# Altium project DIOT_Kasli_Adapter.PrjPCB (part 4 of 4)
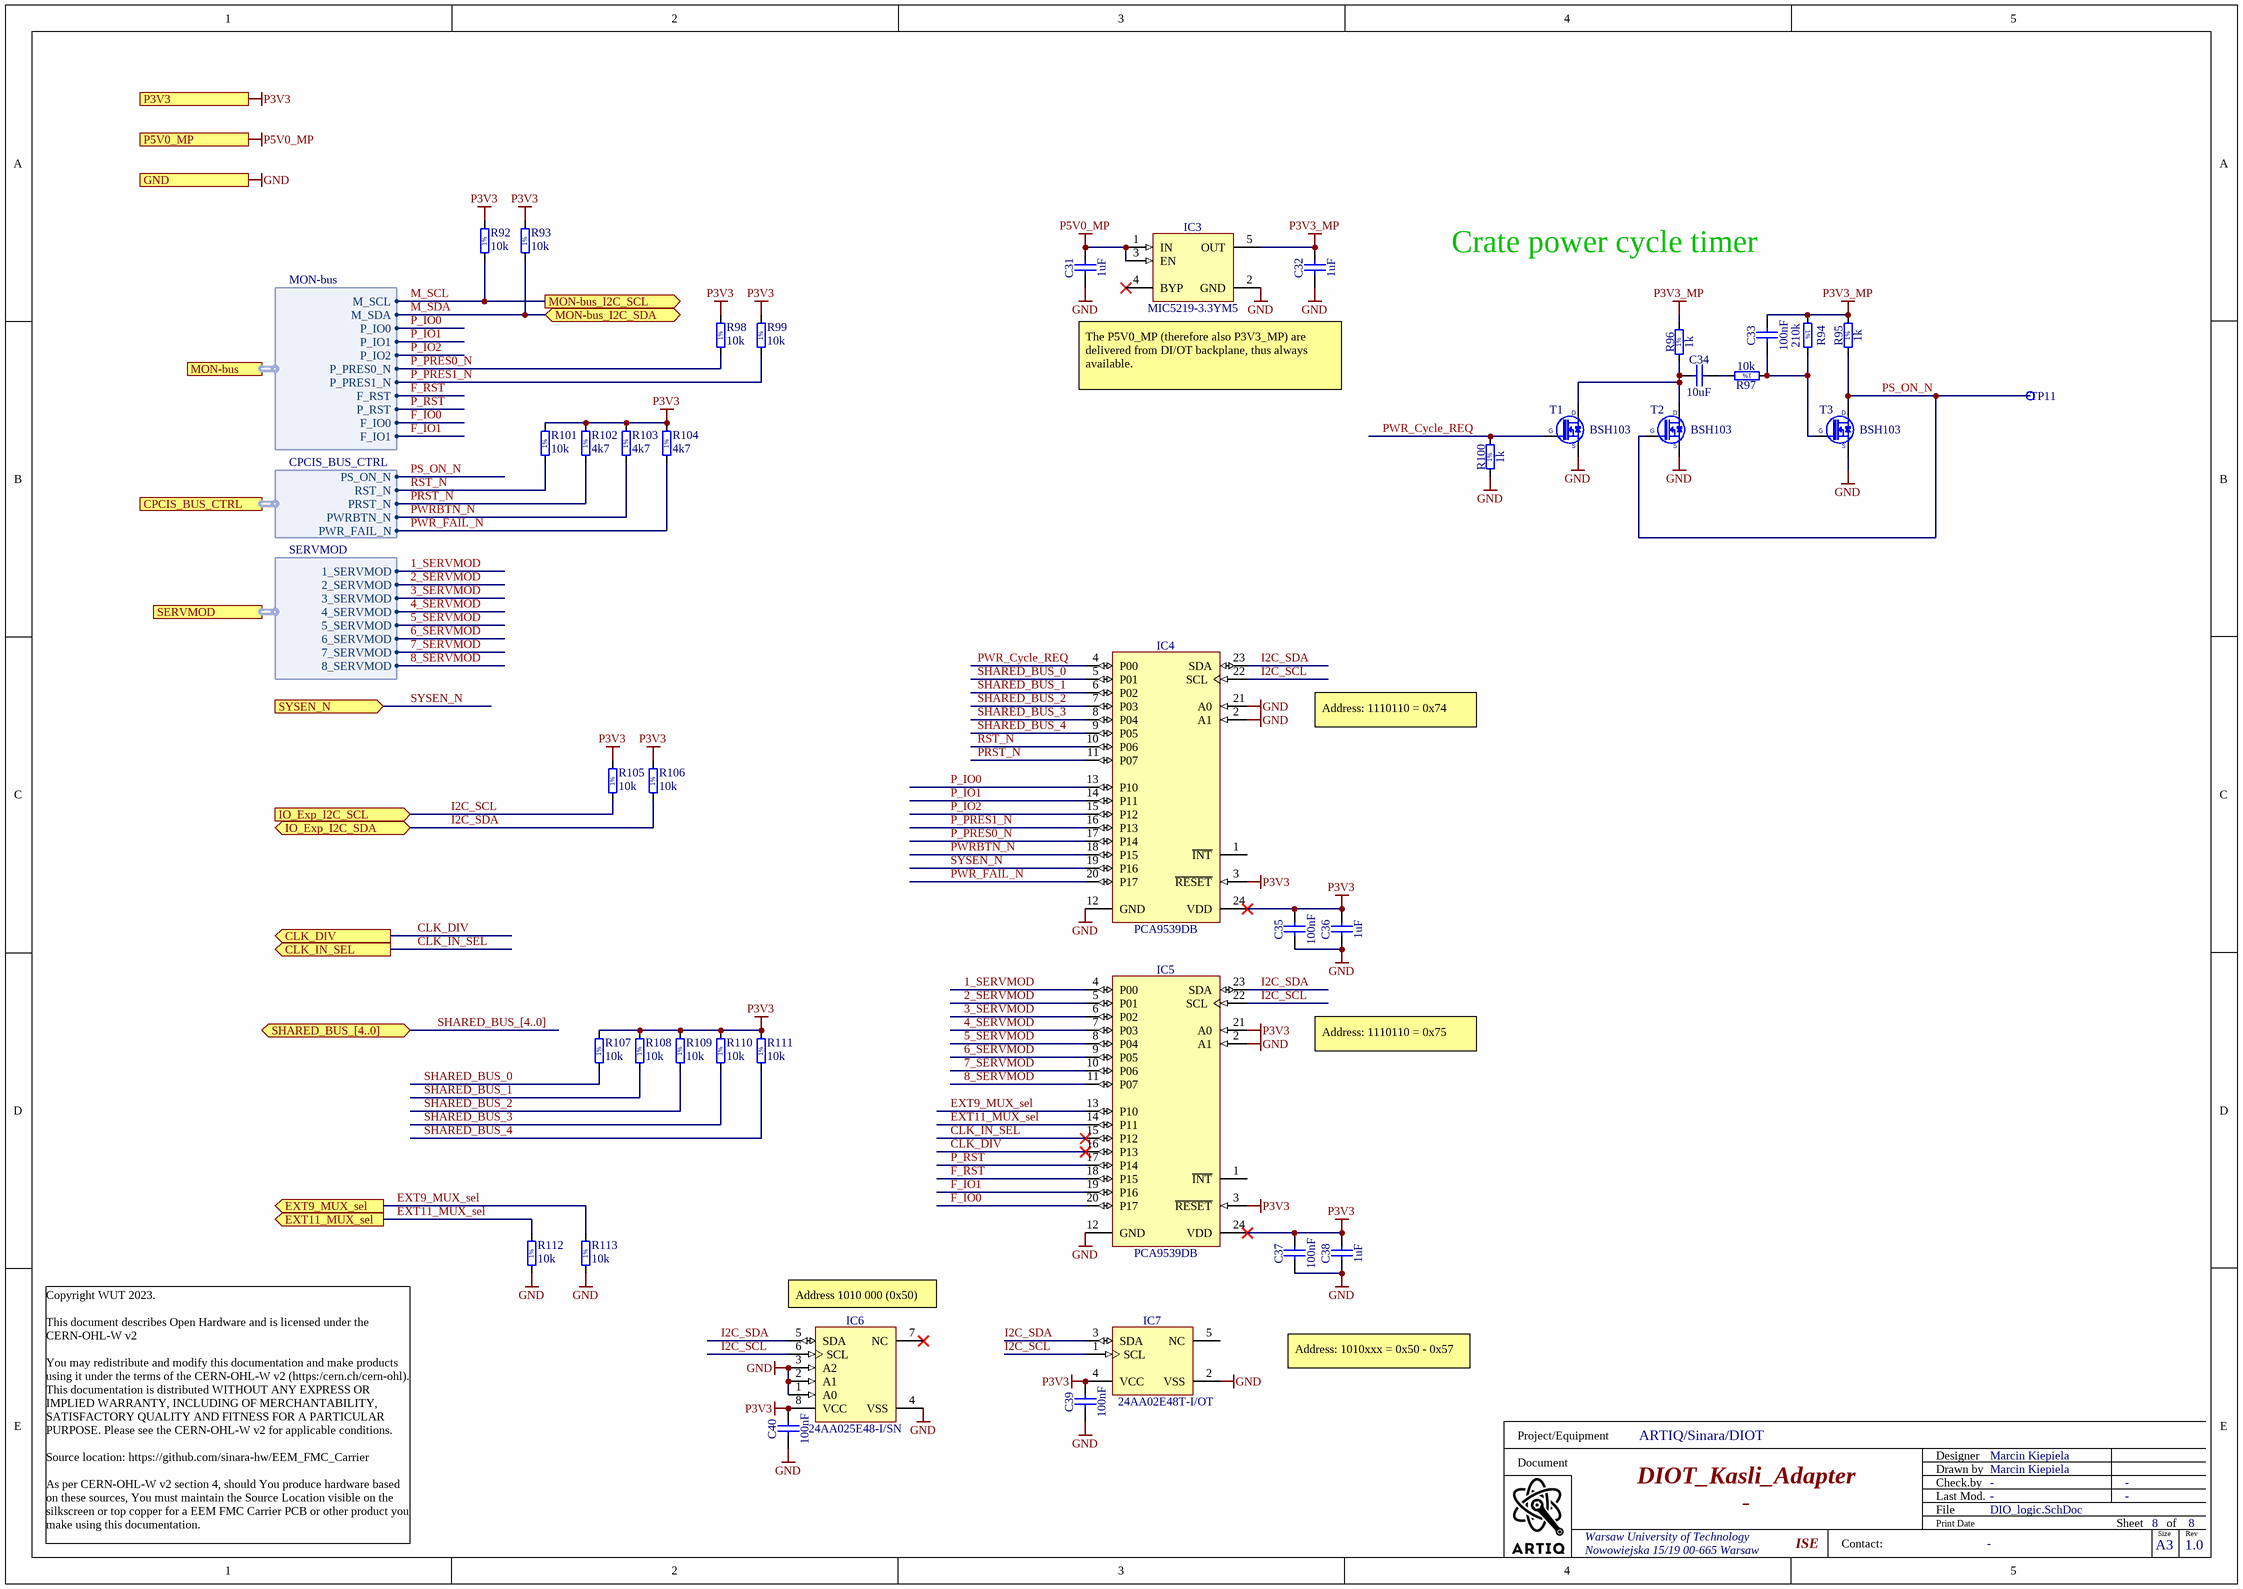
[diagram p8: DIO_logic.SchDoc]

## Nets that join several sheets
GND: DIOT_Kasli_Adapter (6 pins), Cpcis_connectors_P4_P5_P6 (80 pins), IDC_EXT_Connectors (120 pins), Clock_Distribution (30 pins), MUX_EEM_EXT (48 pins), DIO_logic (25 pins)
P3V3: DIOT_Kasli_Adapter (TP9.1), IDC_EXT_Connectors (24 pins), Clock_Distribution (5 pins), MUX_EEM_EXT (16 pins), DIO_logic (28 pins)
P5V0_MP: DIOT_Kasli_Adapter (TP7.1), DIO_logic (C31.2 IC3.1 IC3.3)
P12V0: DIOT_Kasli_Adapter (TP8.1), IDC_EXT_Connectors (24 pins)
1_PE_CLK_N: Cpcis_connectors_P4_P5_P6 (J7.B5), Clock_Distribution (IC1.9)
1_PE_CLK_P: Cpcis_connectors_P4_P5_P6 (J7.A5), Clock_Distribution (IC1.10)
2_PE_CLK_N: Cpcis_connectors_P4_P5_P6 (J7.E5), Clock_Distribution (IC1.7)
2_PE_CLK_P: Cpcis_connectors_P4_P5_P6 (J7.D5), Clock_Distribution (IC1.8)
3_PE_CLK_N: Cpcis_connectors_P4_P5_P6 (J7.H5), Clock_Distribution (IC1.4)
3_PE_CLK_P: Cpcis_connectors_P4_P5_P6 (J7.G5), Clock_Distribution (IC1.5)
4_PE_CLK_N: Cpcis_connectors_P4_P5_P6 (J7.K5), Clock_Distribution (IC1.42)
4_PE_CLK_P: Cpcis_connectors_P4_P5_P6 (J7.J5), Clock_Distribution (IC1.43)
5_PE_CLK_N: Cpcis_connectors_P4_P5_P6 (J7.C6), Clock_Distribution (IC1.37)
5_PE_CLK_P: Cpcis_connectors_P4_P5_P6 (J7.B6), Clock_Distribution (IC1.38)
6_PE_CLK_N: Cpcis_connectors_P4_P5_P6 (J7.F6), Clock_Distribution (IC1.35)
6_PE_CLK_P: Cpcis_connectors_P4_P5_P6 (J7.E6), Clock_Distribution (IC1.36)
7_PE_CLK_N: Cpcis_connectors_P4_P5_P6 (J7.I6), Clock_Distribution (IC1.40)
7_PE_CLK_P: Cpcis_connectors_P4_P5_P6 (J7.H6), Clock_Distribution (IC1.41)
8_PE_CLK_N: Cpcis_connectors_P4_P5_P6 (J7.L6), Clock_Distribution (IC1.29)
8_PE_CLK_P: Cpcis_connectors_P4_P5_P6 (J7.K6), Clock_Distribution (IC1.30)
CLK_DIV: Clock_Distribution (D1.3 R1.1), DIO_logic (IC5.16)
CLK_IN_SEL: Clock_Distribution (R6.1), DIO_logic (IC5.15)
EXT9_MUX_sel: MUX_EEM_EXT (IC8.9 IC9.9 IC10.9 IC11.9), DIO_logic (IC5.13 R113.2)
EXT11_MUX_sel: MUX_EEM_EXT (IC12.9 IC13.9 IC14.9 IC15.9), DIO_logic (IC5.14 R112.2)
I2C_SCL_8: DIOT_Kasli_Adapter (TP1.1), IDC_EXT_Connectors (J17.27), DIO_logic (R92.1)
I2C_SCL_9: DIOT_Kasli_Adapter (TP3.1), IDC_EXT_Connectors (J18.27)
I2C_SCL_11: DIOT_Kasli_Adapter (TP5.1), IDC_EXT_Connectors (J20.27), DIO_logic (5 pins)
I2C_SDA_8: DIOT_Kasli_Adapter (TP2.1), IDC_EXT_Connectors (J17.26), DIO_logic (R93.1)
I2C_SDA_9: DIOT_Kasli_Adapter (TP4.1), IDC_EXT_Connectors (J18.26)
I2C_SDA_11: DIOT_Kasli_Adapter (TP6.1), IDC_EXT_Connectors (J20.26), DIO_logic (5 pins)
SERVMOD.1_SERVMOD: Cpcis_connectors_P4_P5_P6 (J7.C5), DIO_logic (IC5.4)
SERVMOD.2_SERVMOD: Cpcis_connectors_P4_P5_P6 (J7.F5), DIO_logic (IC5.5)
SERVMOD.3_SERVMOD: Cpcis_connectors_P4_P5_P6 (J7.I5), DIO_logic (IC5.6)
SERVMOD.4_SERVMOD: Cpcis_connectors_P4_P5_P6 (J7.L5), DIO_logic (IC5.7)
SERVMOD.5_SERVMOD: Cpcis_connectors_P4_P5_P6 (J7.A6), DIO_logic (IC5.8)
SERVMOD.6_SERVMOD: Cpcis_connectors_P4_P5_P6 (J7.D6), DIO_logic (IC5.9)
SERVMOD.7_SERVMOD: Cpcis_connectors_P4_P5_P6 (J7.G6), DIO_logic (IC5.10)
SERVMOD.8_SERVMOD: Cpcis_connectors_P4_P5_P6 (J7.J6), DIO_logic (IC5.11)

## Assembly variants
Line_15__MGT: not fitted IC7 R11 R13 R29 R31 R44 R46 R48 R50 R52 R54 R56 R58
Line_15__LVDS: not fitted IC7 R12 R14 R30 R32 R45 R47 R49 R51 R53 R55 R57 R59